# EAGLE schematic EfBox_v1 (EAGLE 9.0.0)
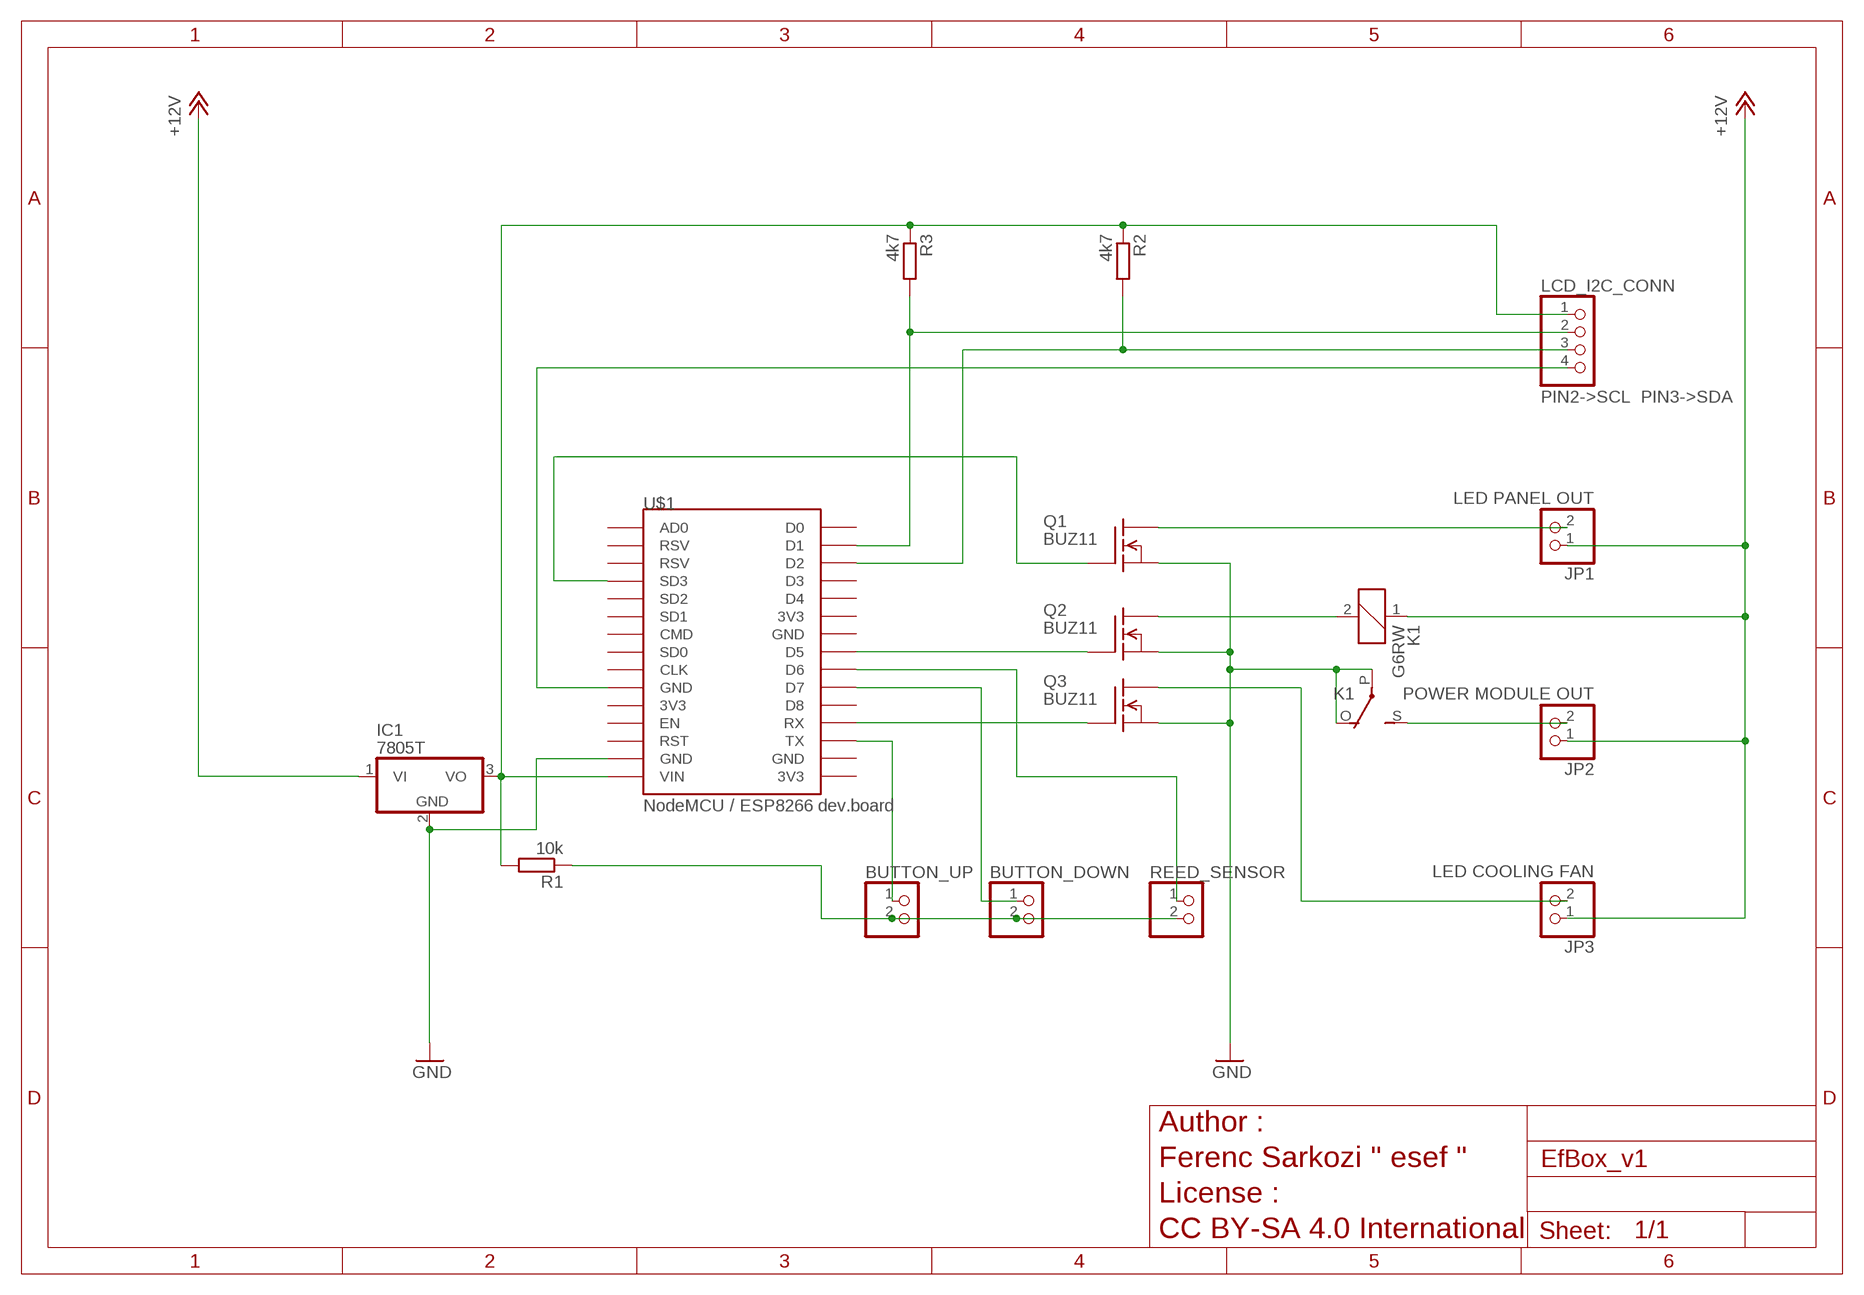
[diagram p0: schematic, sheet 1]

## Parts
BUTTON_DOWN  PINHD-1X2  [1X02]
BUTTON_UP  PINHD-1X2  [1X02]
IC1  7805T  [TO220H]
JP1  LED PANEL OUT  PINHD-1X2  [1X02]
JP2  POWER MODULE OUT  PINHD-1X2  [1X02]
JP3  LED COOLING FAN  PINHD-1X2  [1X02]
K1  G6RW  [G6RW]
LCD_I2C_CONN  PIN2->SCL PIN3->SDA  PINHD-1X4  [1X04]
Q1  BUZ11  [TO220]
Q2  BUZ11  [TO220]
Q3  BUZ11  [TO220]
R1  10k  R-EU_0411/12  [0411/12]
R2  4k7  R-EU_0411/12  [0411/12]
R3  4k7  R-EU_0411/12  [0411/12]
REED_SENSOR  PINHD-1X2  [1X02]
U$1  NodeMCU / ESP8266 dev.board  ESP12E_DEVKIT  [ESP12E_DEVKIT]

## Nets
+12V: IC1.1(VI) JP1.1 JP2.1 JP3.1 K1.1
GND: IC1.2(GND) K1.O(2:O) K1.P(2:P) Q1.3(S) Q2.3(S) Q3.3(S) U$1.GND@1(GND)
N$1: IC1.3(VO) LCD_I2C_CONN.1 R1.2 R2.1 R3.1 U$1.VIN
N$2: Q1.1(G) U$1.SD3
N$3: Q2.1(G) U$1.D5
N$4: Q3.1(G) U$1.RX
N$5: JP3.2 Q3.2(D)
N$6: K1.2 Q2.2(D)
N$7: JP1.2 Q1.2(D)
N$8: JP2.2 K1.S(2:S)
N$9: BUTTON_DOWN.2 BUTTON_UP.2 R1.1 REED_SENSOR.2
N$10: LCD_I2C_CONN.3 R2.2 U$1.D2
N$11: LCD_I2C_CONN.2 R3.2 U$1.D1
N$12: BUTTON_UP.1 U$1.TX
N$13: LCD_I2C_CONN.4 U$1.GND@0(GND)
N$14: BUTTON_DOWN.1 U$1.D7
N$15: REED_SENSOR.1 U$1.D6
Unconnected: U$1.3V3@0(3V3) U$1.3V3@1(3V3) U$1.3V3@2(3V3) U$1.AD0 U$1.CLK U$1.CMD U$1.D0 U$1.D3 U$1.D4 U$1.D8 U$1.EN U$1.GND@2(GND) U$1.GND@3(GND) U$1.RST U$1.RSV@0(RSV) U$1.RSV@1(RSV) U$1.SD0 U$1.SD1 U$1.SD2

## Notes on the sheet
- Author :
- Ferenc Sarkozi " esef "
- License :
- CC BY-SA 4.0 International

## Library data of the parts
BUTTON_DOWN BUTTON_UP JP1-JP3 REED_SENSOR = pinhead:PINHD-1X2: PIN HEADER
IC1 = linear:78*: Positive VOLTAGE REGULATOR Source: http://cache.national.com/ds/LM/LM78L05.pdf http://www.fairchildsemi.com/ds/LM/LM7805.pdf
K1 = relay:G6RW: RELAY 1 x switch, Omron; OC_FARNELL: unknown; OC_NEWARK: unknown
LCD_I2C_CONN = pinhead:PINHD-1X4: PIN HEADER
Q1-Q3 = transistor-fet:BUZ11: N-Channel Enhancement MOSFET 50V; 30A; 0,040Ohm
R1-R3 = resistor:R-EU_: RESISTOR, European symbol
U$1 = ESP12E_DEVKIT:ESP12E_DEVKIT: ESP12E DEVKIT BOARD